# Altium schematic sheet Voltmetr_MEZ_V2.SchDoc
size A4; SheetNumber: 1; SheetTotal: 1
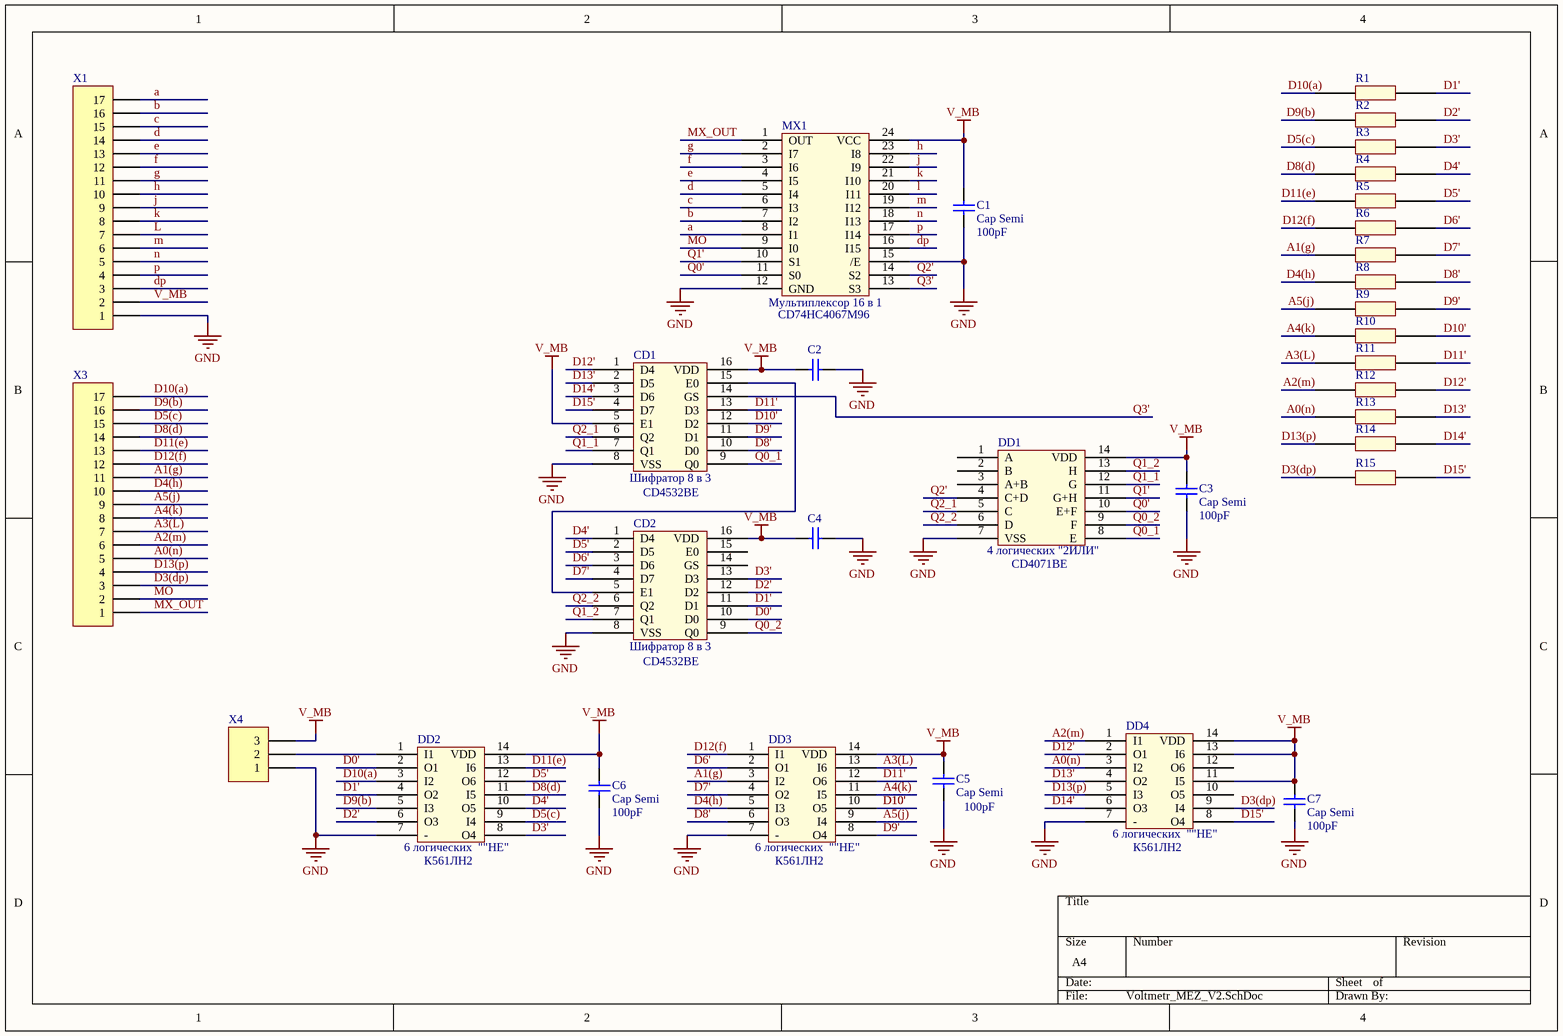
[diagram p0: Voltmetr_MEZ_V2.SchDoc]

## Parts
C1  Cap Semi  value 100pF  [C1206]
C2  Cap Semi  [C1206]  (value not drawn)
C3  Cap Semi  value 100pF  [1608[0603]]
C4  Cap Semi  [C1206]  (value not drawn)
C5  Cap Semi  value 100pF  [C1206]
C6  Cap Semi  value 100pF  [C1206]
C7  Cap Semi  value 100pF  [C1206]
CD1  CD4532BE  [DIP16_PANNEL]
CD2  CD4532BE  [DIP16_PANNEL]
DD1  CD4071BE  [Dip14_pannel]
DD2  К561ЛН2  [Dip14_pannel]
DD3  К561ЛН2  [Dip14_pannel]
DD4  К561ЛН2  [Dip14_pannel]
MX1  CD74HC4067M96  [SOIC-24]
R1  resistor  [RES 0805]  (value not drawn)
R2  resistor  [RES 0805]  (value not drawn)
R3  resistor  [RES 0805]  (value not drawn)
R4  resistor  [RES 0805]  (value not drawn)
R5  resistor  [RES 0805]  (value not drawn)
R6  resistor  [RES 0805]  (value not drawn)
R7  resistor  [RES 0805]  (value not drawn)
R8  resistor  [RES 0805]  (value not drawn)
R9  resistor  [RES 0805]  (value not drawn)
R10  resistor  [RES 0805]  (value not drawn)
R11  resistor  [RES 0805]  (value not drawn)
R12  resistor  [RES 0805]  (value not drawn)
R13  resistor  [RES 0805]  (value not drawn)
R14  resistor  [RES 0805]  (value not drawn)
R15  resistor  [RES 0805]  (value not drawn)
X1  Header 17  [HDR1X17]  (value not drawn)
X3  Header 17  [HDR1X17]  (value not drawn)
X4  Header 3  [HDR1X3]  (value not drawn)

## Nets
GND: C1.1 C2.1 C3.1 C4.1 C5.1 C6.1 C7.1 CD1.8(VSS) CD2.8(VSS) DD1.7(VSS) DD2.7(-) DD3.7(-) DD4.7(-) MX1.12(GND) MX1.15(/E) X1.1 X4.1
V_MB: C1.2 C2.2 C3.2 C4.2 C5.2 C6.2 C7.2 CD1.5(E1) CD1.16(VDD) CD2.16(VDD) DD1.14(VDD) DD2.14(VDD) DD3.14(VDD) DD4.11(I5) DD4.13(I6) DD4.14(VDD) MX1.24(VCC) X1.2 X4.3
~{MO}: MX1.9(I0) X3.2
a: MX1.8(I1) X1.17
A0(n): DD4.3(I2) R13.1 X3.5
A1(g): DD3.3(I2) R7.1 X3.11
A2(m): DD4.1(I1) R12.1 X3.6
A3(L): DD3.13(I6) R11.1 X3.7
A4(k): DD3.11(I5) R10.1 X3.8
A5(j): DD3.9(I4) R9.1 X3.9
b: MX1.7(I2) X1.16
c: MX1.6(I3) X1.15
d: MX1.5(I4) X1.14
D0': CD2.10(D0) DD2.2(O1)
D1': CD2.11(D1) DD2.4(O2) R1.2
D2': CD2.12(D2) DD2.6(O3) R2.2
D3': CD2.13(D3) DD2.8(O4) R3.2
D3(dp): DD4.9(I4) R15.1 X3.3
D4': CD2.1(D4) DD2.10(O5) R4.2
D4(h): DD3.5(I3) R8.1 X3.10
D5': CD2.2(D5) DD2.12(O6) R5.2
D5(c): DD2.9(I4) R3.1 X3.15
D6': CD2.3(D6) DD3.2(O1) R6.2
D7': CD2.4(D7) DD3.4(O2) R7.2
D8': CD1.10(D0) DD3.6(O3) R8.2
D8(d): DD2.11(I5) R4.1 X3.14
D9': CD1.11(D1) DD3.8(O4) R9.2
D9(b): DD2.5(I3) R2.1 X3.16
D10': CD1.12(D2) DD3.10(O5) R10.2
D10(a): DD2.3(I2) R1.1 X3.17
D11': CD1.13(D3) DD3.12(O6) R11.2
D11(e): DD2.13(I6) R5.1 X3.13
D12': CD1.1(D4) DD4.2(O1) R12.2
D12(f): DD3.1(I1) R6.1 X3.12
D13': CD1.2(D5) DD4.4(O2) R13.2
D13(p): DD4.5(I3) R14.1 X3.4
D14': CD1.3(D6) DD4.6(O3) R14.2
D15': CD1.4(D7) DD4.8(O4) R15.2
dp: MX1.16(I15) X1.3
e: MX1.4(I5) X1.13
f: MX1.3(I6) X1.12
g: MX1.2(I7) X1.11
h: MX1.23(I8) X1.10
j: MX1.22(I9) X1.9
k: MX1.21(I10) X1.8
l: MX1.20(I11) X1.7
m: MX1.19(I12) X1.6
MX_OUT: MX1.1(OUT) X3.1
n: MX1.18(I13) X1.5
p: MX1.17(I14) X1.4
Q0': DD1.10(E+F) MX1.11(S0)
Q0_1: CD1.9(Q0) DD1.8(E)
Q0_2: CD2.9(Q0) DD1.9(F)
Q1': DD1.11(G+H) MX1.10(S1)
Q1_1: CD1.7(Q1) DD1.12(G)
Q1_2: CD2.7(Q1) DD1.13(H)
Q2': DD1.4(C+D) MX1.14(S2)
Q2_1: CD1.6(Q2) DD1.5(C)
Q2_2: CD2.6(Q2) DD1.6(D)
Q3': CD1.14(GS) MX1.13(S3)
NetCD1_15: CD1.15(E0) CD2.5(E1)
NetDD2_1: DD2.1(I1) X4.2

Not connected (* = marked no-connect by the designer): CD2 14(GS) 15(E0); DD1 1(A) 2(B) 3(A+B); DD4 10(O5) 12(O6)

## Notes on the sheet
- (in symbol CD74HC4067M96) Мультиплексор 16 в 1
- (in symbol CD4071BE) 4 логических "2ИЛИ"
- (in symbol CD4532BE) Шифратор 8 в 3
- (in symbol К561ЛН2) 6 логических  ""НЕ"

## Library data of the parts
C1-C7 = Cap Semi: Capacitor (Semiconductor SIM Model); Published: 8-Jun-2000; LatestRevisionDate: 29-May-2009; LatestRevisionNote: IPC-7351 Footprint Added.; PackageReference: C1206; Publisher: Altium Limited; PackageDescription: Chip Capacitor
CD1 CD2 = CD4532BE: Шифратор приоритетный 8 - 3 [DIP-16]
DD1 = CD4071BE: Четыре логических элемента "2ИЛИ", [DIP-14]
DD2-DD4 = К561ЛН2: Шесть логических элементов "HЕ" (DIP-14)
MX1 = CD74HC4067M96: 16-и канальный аналоговый мультиплексор/ демультиплексор, [SO-24]
R1-R15 = RES
X1 X3 = Header 17: Header, 17-Pin; LatestRevisionDate: 17-Jul-2002; LatestRevisionNote: Re-released for DXP Platform.; Publisher: Altium Limited
X4 = Header 3: Header, 3-Pin; LatestRevisionDate: 17-Jul-2002; LatestRevisionNote: Re-released for DXP Platform.; Publisher: Altium Limited